# Altium schematic sheet MAGI'sOLED.SchDoc
size A4
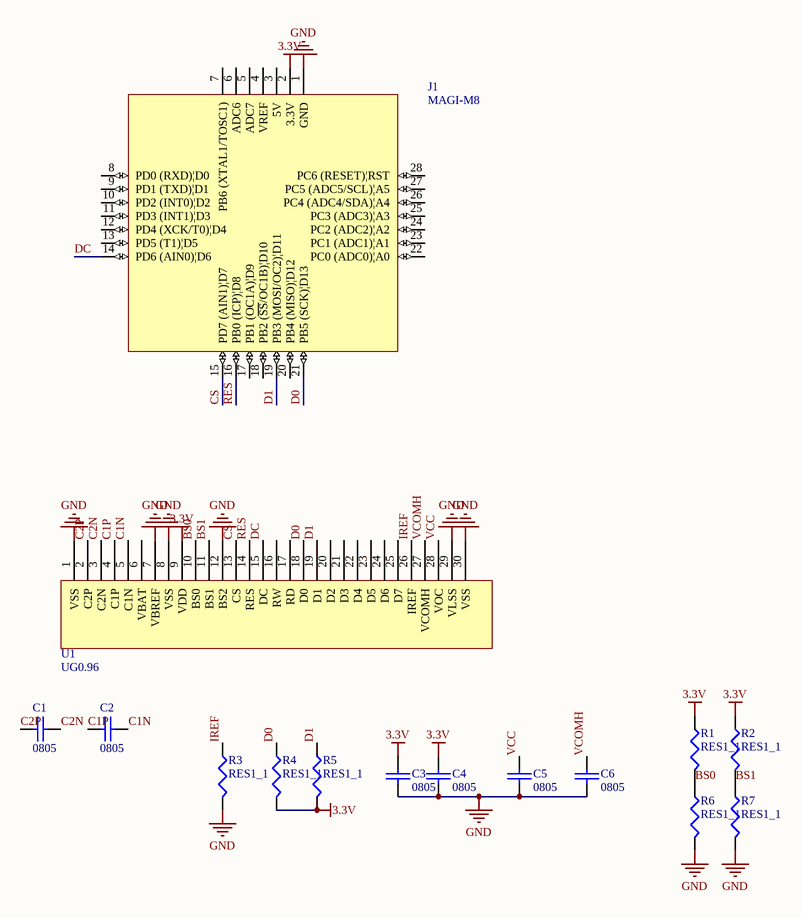
[diagram p0: MAGI'sOLED.SchDoc]

## Parts
C1  0805  [6-0805_N]
C2  0805  [6-0805_N]
C3  0805  [6-0805_N]
C4  0805  [6-0805_N]
C5  0805  [6-0805_N]
C6  0805  [6-0805_N]
J1  MAGI-M8  [MAGI-M8]
R1  RES1_1  [1608[0603]]
R2  RES1_1  [1608[0603]]
R3  RES1_1  [6-0805_n]
R4  RES1_1  [6-0805_n]
R5  RES1_1  [6-0805_n]
R6  RES1_1  [1608[0603]]
R7  RES1_1  [1608[0603]]
U1  UG0.96  [UG0.96]

## Nets
3.3V: C3.2 C4.2 J1.2(3.3V) R1.1 R2.1 R4.2 R5.2 U1.9(VDD)
GND: C3.1 C4.1 C5.1 C6.1 J1.1(GND) R3.2 R6.2 R7.2 U1.1(VSS) U1.7(VBREF) U1.8(VSS) U1.12(BS2) U1.29(VLSS) U1.30(VSS)
BS0: R1.2 R6.1 U1.10(BS0)
BS1: R2.2 R7.1 U1.11(BS1)
C1N: C2.2 U1.5(C1N)
C1P: C2.1 U1.4(C1P)
C2N: C1.2 U1.3(C2N)
C2P: C1.1 U1.2(C2P)
CS: J1.15(PD7_(AIN1)|D7) U1.13(CS)
D0: J1.21(PB5_(SCK)|D13) R4.1 U1.18(D0)
D1: J1.19(PB3_(MOSI/OC2)|D11) R5.1 U1.19(D1)
DC: J1.14(PD6_(AIN0)|D6) U1.15(DC)
IREF: R3.1 U1.26(IREF)
RES: J1.16(PB0_(ICP)|D8) U1.14(RES)
VCC: C5.2 U1.28(VOC)
VCOMH: C6.2 U1.27(VCOMH)

Not connected (* = marked no-connect by the designer): J1 3(5V) 4(VREF) 5(ADC7) 6(ADC6) 7(PB6_(XTAL1/TOSC1)) 8(PD0_(RXD)|D0) 9(PD1_(TXD)|D1) 10(PD2_(INT0)|D2) 11(PD3_(INT1)|D3) 12(PD4_(XCK/T0)|D4) 13(PD5_(T1)|D5) 17(PB1_(OC1A)|D9) 18(PB2_(~{SS}/OC1B)|D10) 20(PB4_(MISO)|D12) 22(PC0_(ADC0)|A0) 23(PC1_(ADC1)|A1) 24(PC2_(ADC2)|A2) 25(PC3_(ADC3)|A3) 26(PC4_(ADC4/SDA)|A4) 27(PC5_(ADC5/SCL)|A5) 28(PC6_(RESET)|RST); U1 6(VBAT) 16(RW) 17(RD) 20(D2) 21(D3) 22(D4) 23(D5) 24(D6) 25(D7)

## Library data of the parts
C1-C6 = CAP_1: Capacitor